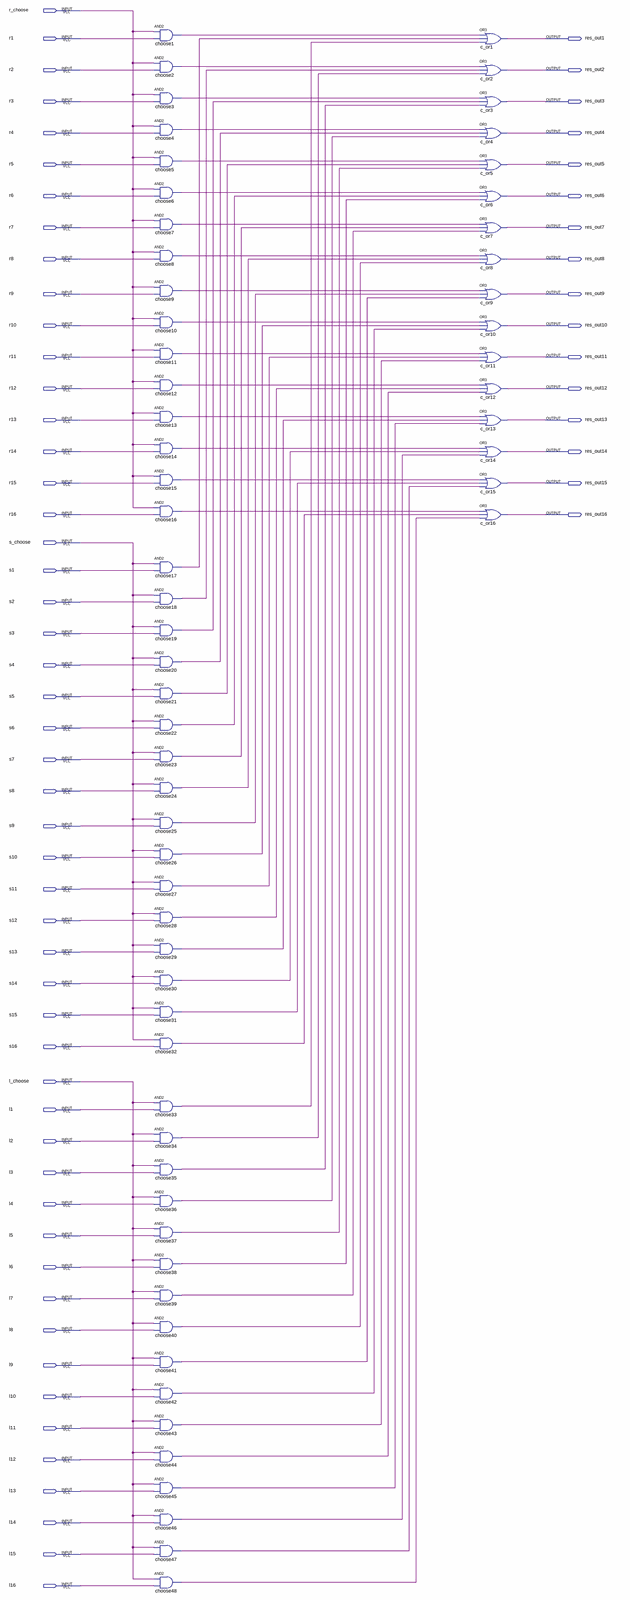
[diagram p0: schematic sheet, whole]
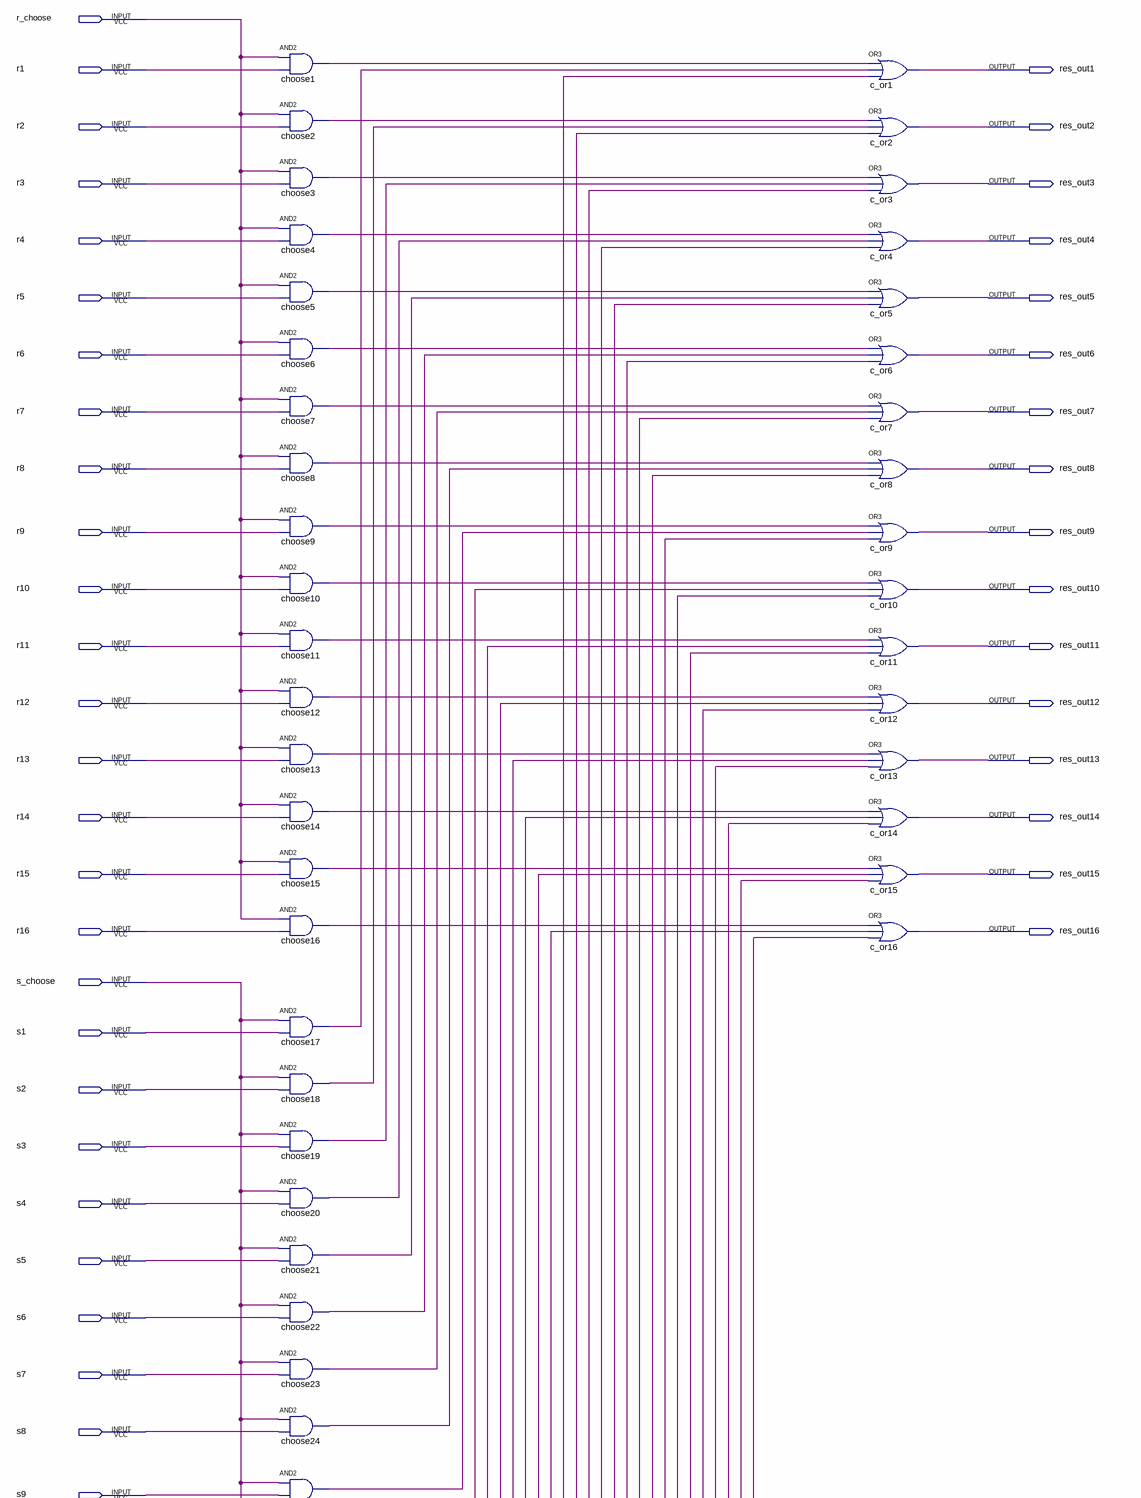
[diagram p1: schematic sheet, upper part]
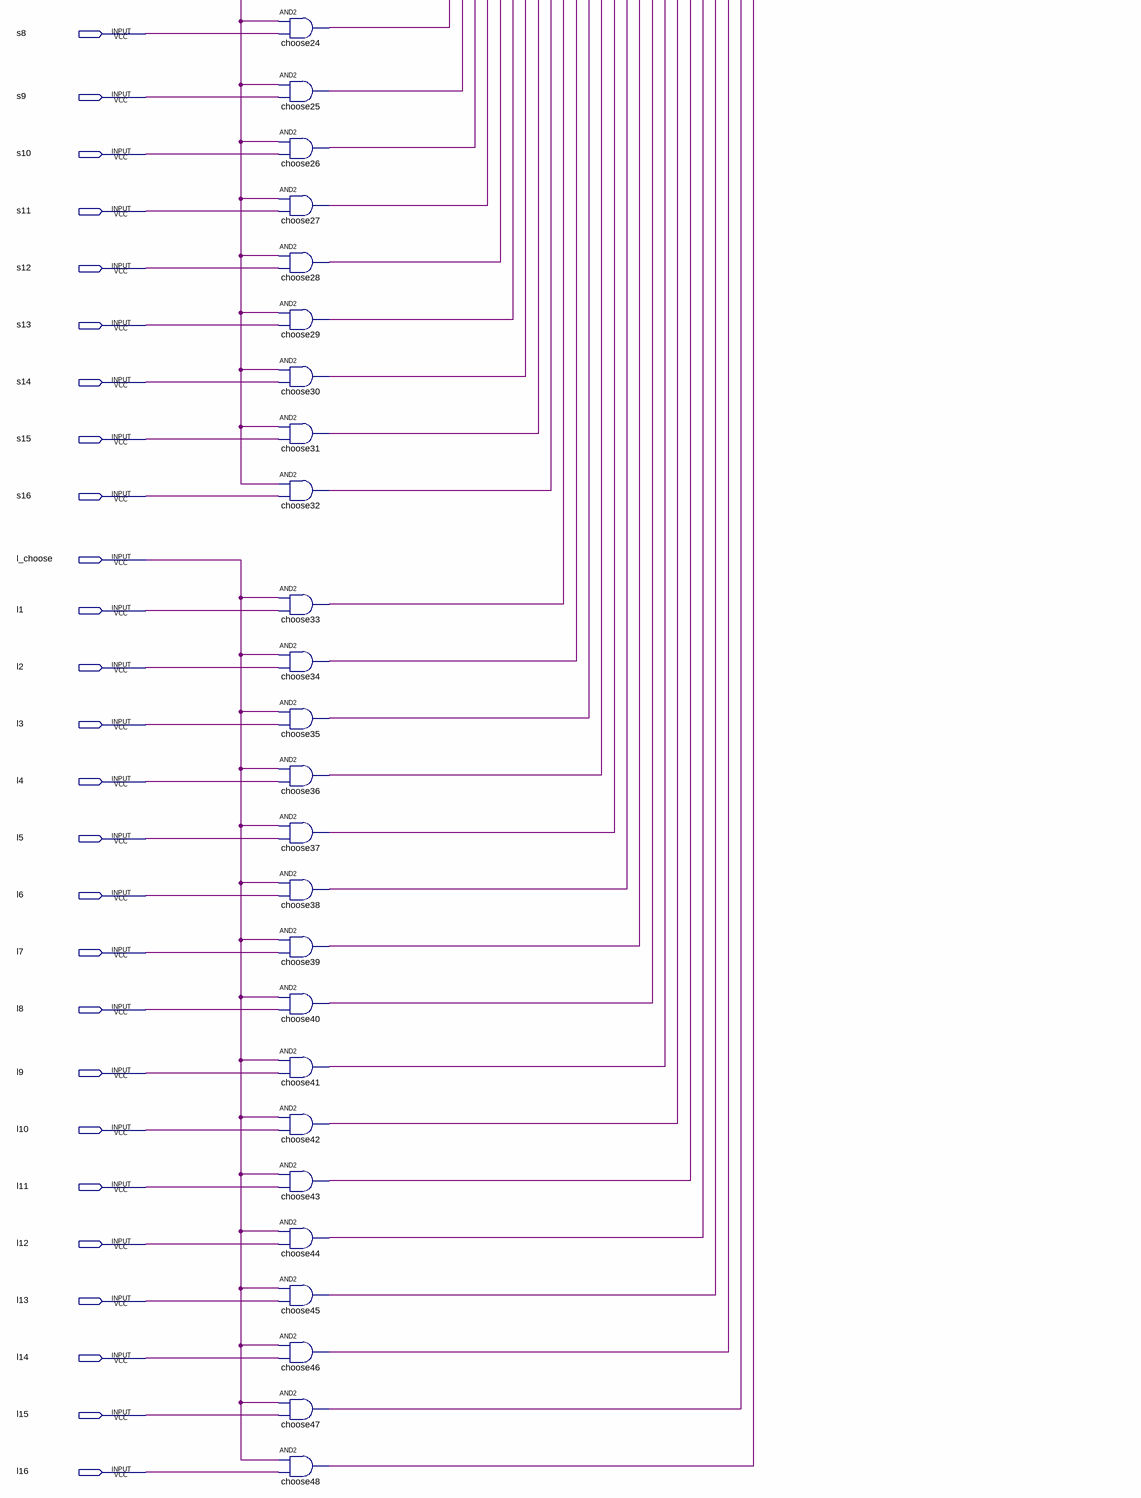
[diagram p2: schematic sheet, lower part]
// Quartus schematic CHOOSE_LAB3.bdf as structural Verilog: 64 symbols, 67 pins
module CHOOSE_LAB3 (
  input  r_choose,
  input  r1,
  input  r2,
  input  r3,
  input  r4,
  input  r5,
  input  r6,
  input  r7,
  input  r8,
  input  r9,
  input  r10,
  input  r11,
  input  r12,
  input  r13,
  input  r14,
  input  r15,
  input  r16,
  input  s_choose,
  input  s1,
  input  s2,
  input  s3,
  input  s4,
  input  s5,
  input  s6,
  input  s7,
  input  s8,
  input  s9,
  input  s10,
  input  s11,
  input  s12,
  input  s13,
  input  s14,
  input  s15,
  input  s16,
  input  l_choose,
  input  l1,
  input  l2,
  input  l3,
  input  l4,
  input  l5,
  input  l6,
  input  l7,
  input  l8,
  input  l9,
  input  l10,
  input  l11,
  input  l12,
  input  l13,
  input  l14,
  input  l15,
  input  l16,
  output res_out1,
  output res_out2,
  output res_out3,
  output res_out4,
  output res_out5,
  output res_out6,
  output res_out7,
  output res_out8,
  output res_out9,
  output res_out10,
  output res_out11,
  output res_out12,
  output res_out13,
  output res_out14,
  output res_out15,
  output res_out16
);

  wire choose1_out, choose2_out, choose3_out, choose4_out, choose5_out, choose6_out, choose7_out,
       choose8_out, choose9_out, choose10_out, choose11_out, choose12_out, choose13_out, choose14_out,
       choose15_out, choose16_out, choose17_out, choose18_out, choose19_out, choose20_out, choose21_out,
       choose22_out, choose23_out, choose24_out, choose25_out, choose26_out, choose27_out, choose28_out,
       choose29_out, choose30_out, choose31_out, choose32_out, choose33_out, choose34_out, choose35_out,
       choose36_out, choose37_out, choose38_out, choose39_out, choose40_out, choose41_out, choose42_out,
       choose43_out, choose44_out, choose45_out, choose46_out, choose47_out, choose48_out;

  and choose1 (choose1_out, r_choose, r1);
  and choose2 (choose2_out, r_choose, r2);
  and choose3 (choose3_out, r_choose, r3);
  and choose4 (choose4_out, r_choose, r4);
  and choose5 (choose5_out, r_choose, r5);
  and choose6 (choose6_out, r_choose, r6);
  and choose7 (choose7_out, r_choose, r7);
  and choose8 (choose8_out, r_choose, r8);
  and choose9 (choose9_out, r_choose, r9);
  and choose10 (choose10_out, r_choose, r10);
  and choose11 (choose11_out, r_choose, r11);
  and choose12 (choose12_out, r_choose, r12);
  and choose13 (choose13_out, r_choose, r13);
  and choose14 (choose14_out, r_choose, r14);
  and choose15 (choose15_out, r_choose, r15);
  and choose16 (choose16_out, r_choose, r16);
  and choose17 (choose17_out, s_choose, s1);
  and choose18 (choose18_out, s_choose, s2);
  and choose19 (choose19_out, s_choose, s3);
  and choose20 (choose20_out, s_choose, s4);
  and choose21 (choose21_out, s_choose, s5);
  and choose22 (choose22_out, s_choose, s6);
  and choose23 (choose23_out, s_choose, s7);
  and choose24 (choose24_out, s_choose, s8);
  and choose25 (choose25_out, s_choose, s9);
  and choose26 (choose26_out, s_choose, s10);
  and choose27 (choose27_out, s_choose, s11);
  and choose28 (choose28_out, s_choose, s12);
  and choose29 (choose29_out, s_choose, s13);
  and choose30 (choose30_out, s_choose, s14);
  and choose31 (choose31_out, s_choose, s15);
  and choose32 (choose32_out, s_choose, s16);
  and choose33 (choose33_out, l_choose, l1);
  and choose34 (choose34_out, l_choose, l2);
  and choose35 (choose35_out, l_choose, l3);
  and choose36 (choose36_out, l_choose, l4);
  and choose37 (choose37_out, l_choose, l5);
  and choose38 (choose38_out, l_choose, l6);
  and choose39 (choose39_out, l_choose, l7);
  and choose40 (choose40_out, l_choose, l8);
  and choose41 (choose41_out, l_choose, l9);
  and choose42 (choose42_out, l_choose, l10);
  and choose43 (choose43_out, l_choose, l11);
  and choose44 (choose44_out, l_choose, l12);
  and choose45 (choose45_out, l_choose, l13);
  and choose46 (choose46_out, l_choose, l14);
  and choose47 (choose47_out, l_choose, l15);
  and choose48 (choose48_out, l_choose, l16);
  or c_or1 (res_out1, choose1_out, choose17_out, choose33_out);
  or c_or2 (res_out2, choose2_out, choose18_out, choose34_out);
  or c_or3 (res_out3, choose3_out, choose19_out, choose35_out);
  or c_or4 (res_out4, choose4_out, choose20_out, choose36_out);
  or c_or5 (res_out5, choose5_out, choose21_out, choose37_out);
  or c_or6 (res_out6, choose6_out, choose22_out, choose38_out);
  or c_or7 (res_out7, choose7_out, choose23_out, choose39_out);
  or c_or8 (res_out8, choose8_out, choose24_out, choose40_out);
  or c_or9 (res_out9, choose9_out, choose25_out, choose41_out);
  or c_or10 (res_out10, choose10_out, choose26_out, choose42_out);
  or c_or11 (res_out11, choose11_out, choose27_out, choose43_out);
  or c_or12 (res_out12, choose12_out, choose28_out, choose44_out);
  or c_or13 (res_out13, choose13_out, choose29_out, choose45_out);
  or c_or14 (res_out14, choose14_out, choose30_out, choose46_out);
  or c_or15 (res_out15, choose15_out, choose31_out, choose47_out);
  or c_or16 (res_out16, choose16_out, choose32_out, choose48_out);
endmodule
